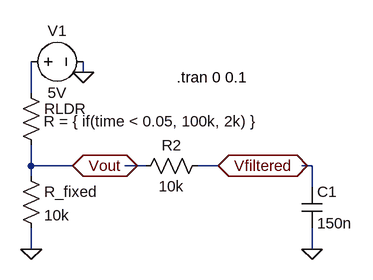
[diagram p0: schematic LDR.asc]
LDR.asc, the LTspice schematic file:
Version 4.1
SHEET 1 880 680
WIRE 96 48 96 32
WIRE 16 80 16 32
WIRE 16 192 16 160
WIRE 80 192 16 192
WIRE 192 192 160 192
WIRE 304 192 272 192
WIRE 448 192 432 192
WIRE 16 208 16 192
WIRE 448 224 448 192
WIRE 16 320 16 288
WIRE 448 320 448 288
FLAG 16 320 0
FLAG 80 192 Vout
IOPIN 80 192 BiDir
FLAG 96 48 0
FLAG 304 192 Vfiltered
IOPIN 304 192 BiDir
FLAG 448 320 0
SYMBOL voltage 0 32 R270
WINDOW 0 32 56 VTop 2
WINDOW 3 -32 56 VBottom 2
WINDOW 123 0 0 Left 0
WINDOW 39 0 0 Left 0
SYMATTR InstName V1
SYMATTR Value 5V
SYMBOL res 0 64 R0
WINDOW 3 35 59 Left 2
SYMATTR InstName RLDR
SYMATTR Value R = { if(time < 0.05, 100k, 2k) }
SYMBOL res 0 192 R0
SYMATTR InstName R_fixed
SYMATTR Value 10k
SYMBOL res 288 176 R90
WINDOW 0 0 56 VBottom 2
WINDOW 3 32 56 VTop 2
SYMATTR InstName R2
SYMATTR Value 10k
SYMBOL cap 432 224 R0
SYMATTR InstName C1
SYMATTR Value 150n
TEXT 240 56 Left 2 !.tran 0 0.1

The netlist it stands for:
* LDR.asc
V1 N001 0 5V
RLDR N001 Vout R = { if(time < 0.05, 100k, 2k) }
R_fixed Vout 0 10k
R2 Vfiltered N002 10k
C1 N003 0 150n
.tran 0 0.1
.backanno
.end